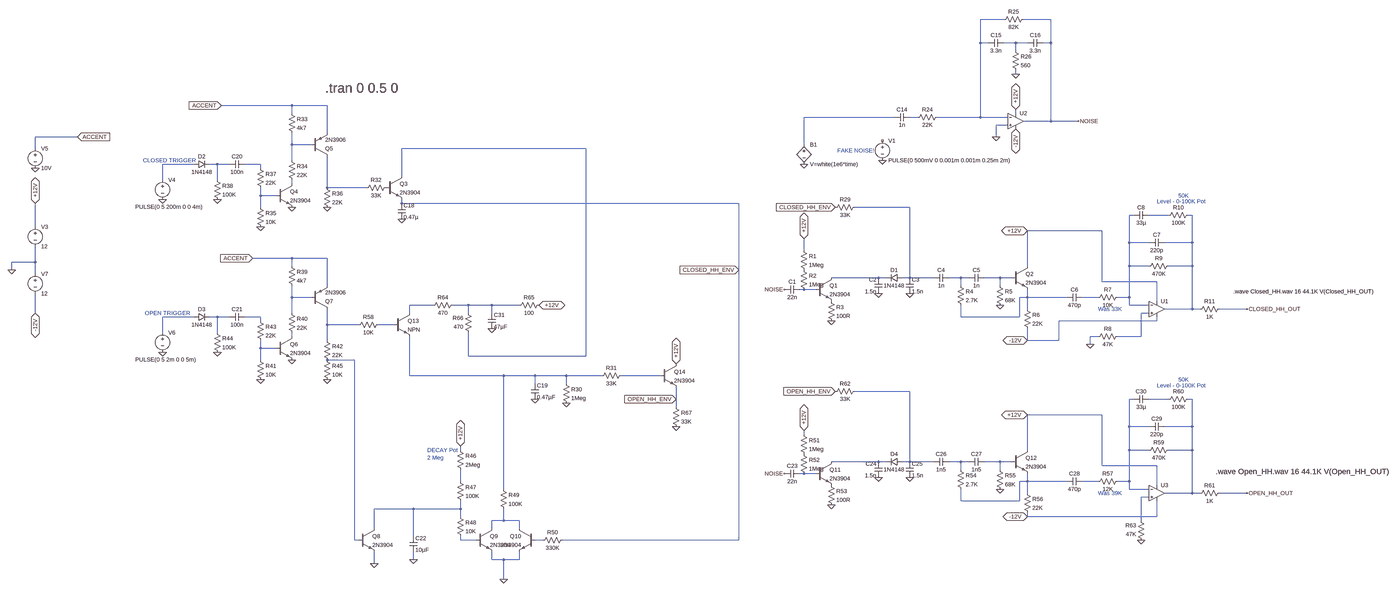
[diagram p0: schematic HH,asc.asc, whole sheet]
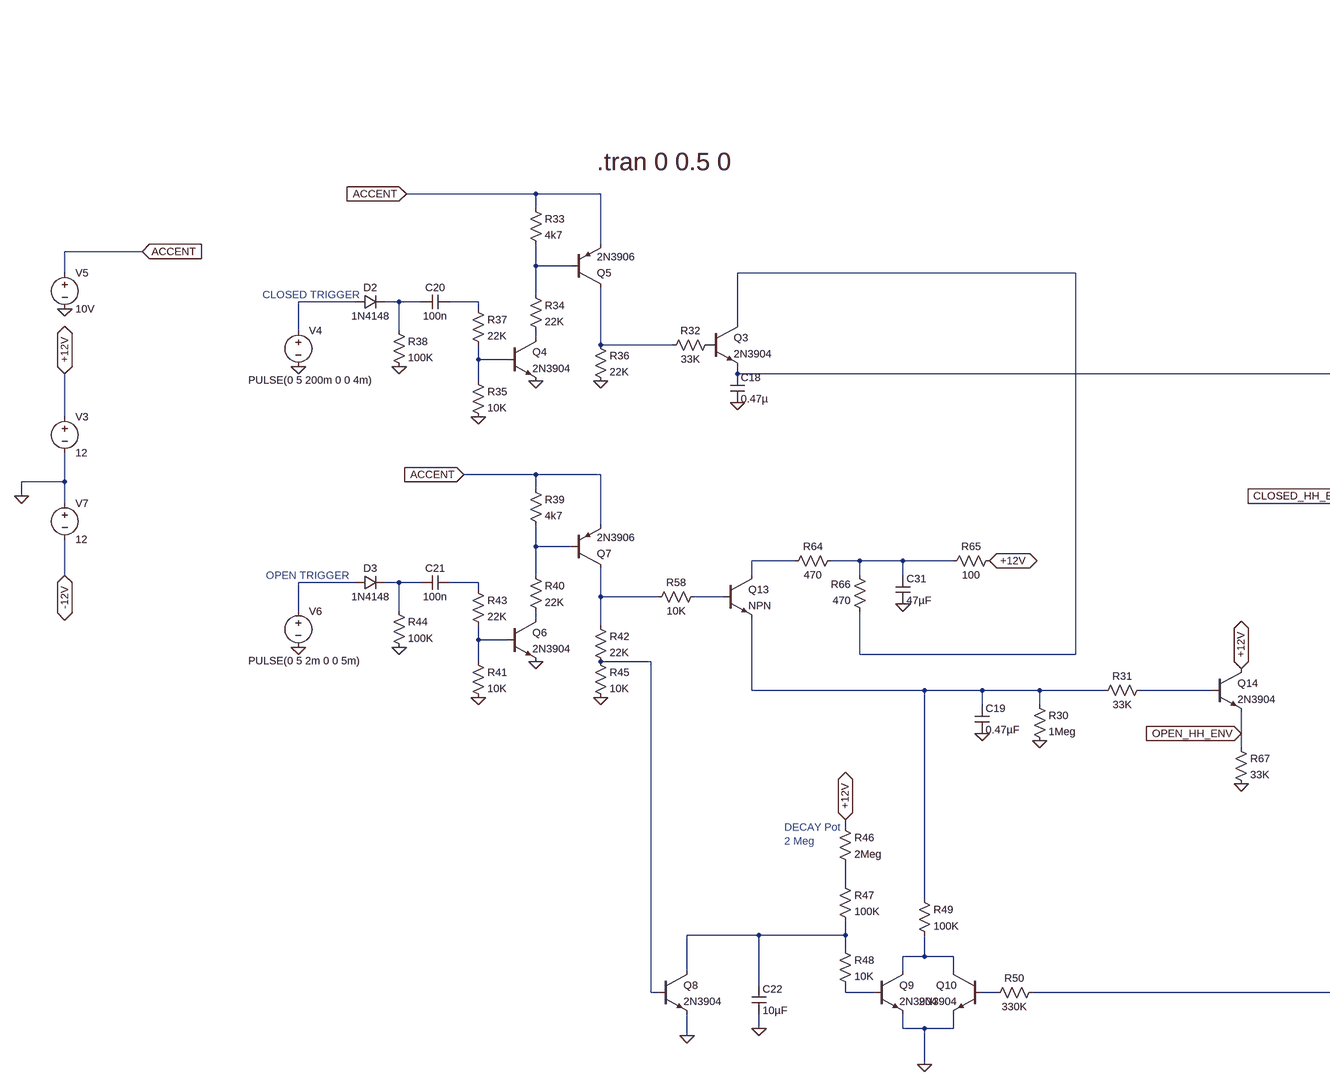
[diagram p1: schematic HH,asc.asc, part, row 1 of 1, column 1 of 2]
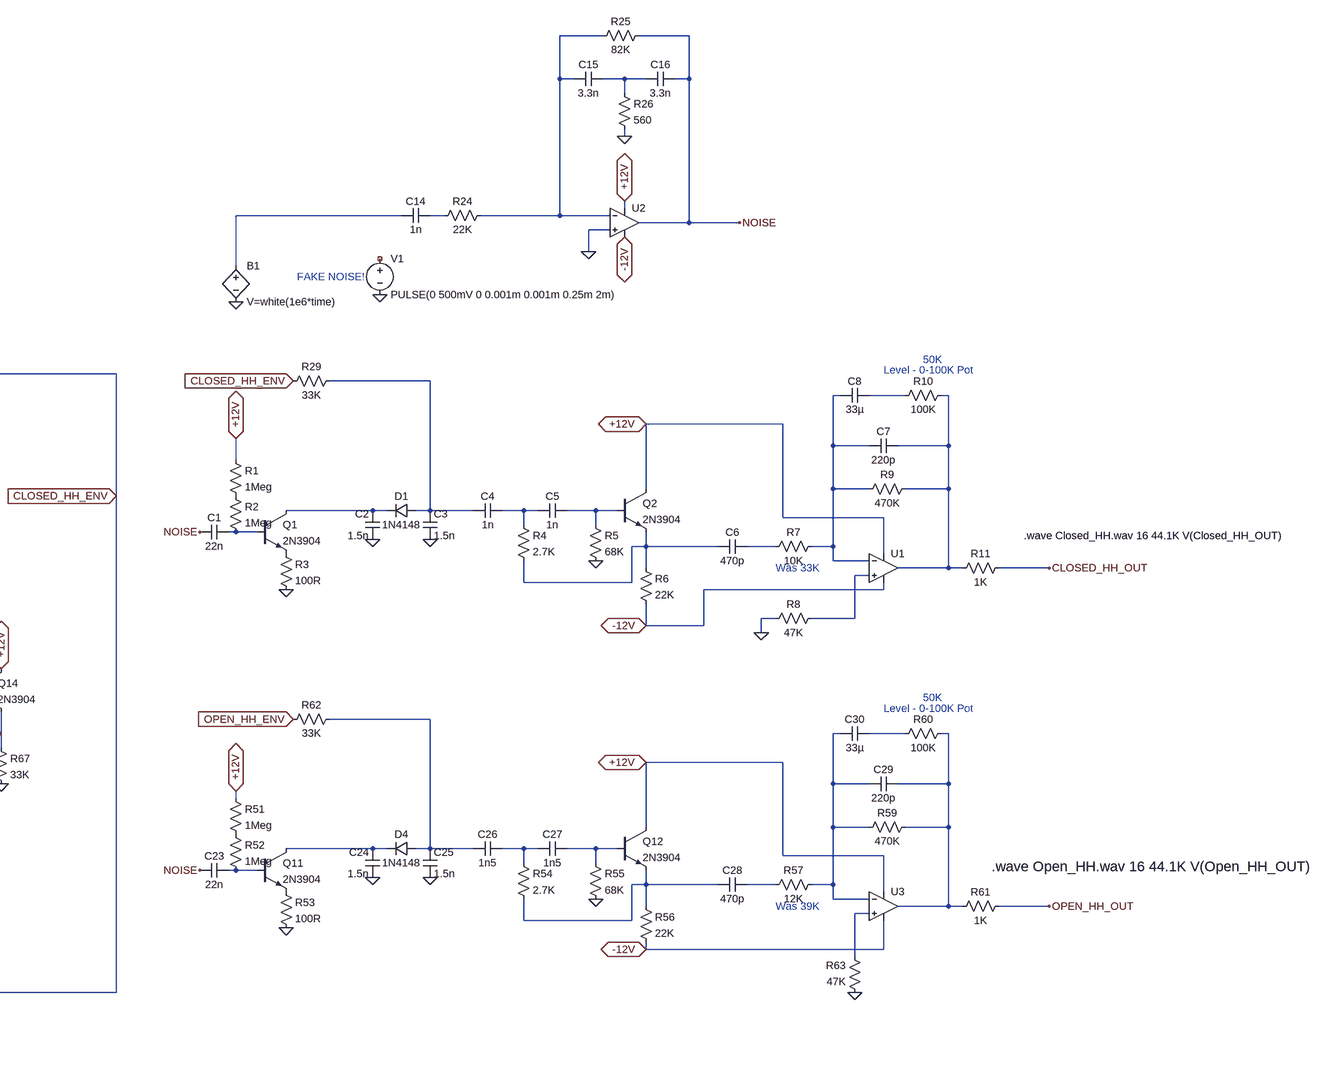
[diagram p2: schematic HH,asc.asc, part, row 1 of 1, column 2 of 2]
HH,asc.asc, the LTspice schematic file:
Version 4
SHEET 1 3256 2740
WIRE 1632 208 1536 208
WIRE 1824 208 1712 208
WIRE 1536 304 1536 208
WIRE 1568 304 1536 304
WIRE 1680 304 1632 304
WIRE 1728 304 1680 304
WIRE 1824 304 1824 208
WIRE 1824 304 1792 304
WIRE 1680 336 1680 304
WIRE 1680 432 1680 416
WIRE -1472 560 -1760 560
WIRE -1328 560 -1472 560
WIRE -1472 592 -1472 560
WIRE 1680 592 1680 576
WIRE 1184 608 816 608
WIRE 1280 608 1248 608
WIRE 1536 608 1536 304
WIRE 1536 608 1360 608
WIRE 1648 608 1536 608
WIRE 1824 624 1824 304
WIRE 1824 624 1712 624
WIRE 1936 624 1824 624
WIRE 1648 640 1600 640
WIRE -1328 672 -1328 560
WIRE -2544 688 -2736 688
WIRE 1600 688 1600 640
WIRE -1472 720 -1472 672
WIRE -1392 720 -1472 720
WIRE 816 720 816 608
WIRE -2736 736 -2736 688
WIRE -272 736 -1024 736
WIRE -1472 784 -1472 720
WIRE -1872 800 -2000 800
WIRE -1776 800 -1808 800
WIRE -1728 800 -1776 800
WIRE -1600 800 -1664 800
WIRE -1600 816 -1600 800
WIRE -1024 848 -1024 736
WIRE -2000 864 -2000 800
WIRE -1776 864 -1776 800
WIRE -1472 880 -1472 864
WIRE -1328 896 -1328 768
WIRE -1168 896 -1328 896
WIRE -1600 928 -1600 896
WIRE -1536 928 -1600 928
WIRE -1024 960 -1024 944
WIRE 352 960 -1024 960
WIRE -1600 976 -1600 928
WIRE 1248 976 1024 976
WIRE 2160 1008 2144 1008
WIRE 2304 1008 2224 1008
WIRE 2400 1008 2384 1008
WIRE -2736 1056 -2736 960
WIRE 2032 1072 1728 1072
WIRE 2144 1120 2144 1008
WIRE 2224 1120 2144 1120
WIRE 2400 1120 2400 1008
WIRE 2400 1120 2288 1120
WIRE 816 1152 816 1104
WIRE -1472 1184 -1632 1184
WIRE -1328 1184 -1472 1184
WIRE -2736 1200 -2736 1136
WIRE -2736 1200 -2832 1200
WIRE -1472 1216 -1472 1184
WIRE 1728 1216 1728 1072
WIRE 2144 1216 2144 1120
WIRE 2224 1216 2144 1216
WIRE 2400 1216 2400 1120
WIRE 2400 1216 2304 1216
WIRE -2832 1232 -2832 1200
WIRE 352 1232 352 960
WIRE -2736 1248 -2736 1200
WIRE 1120 1264 928 1264
WIRE 1152 1264 1120 1264
WIRE 1248 1264 1248 976
WIRE 1248 1264 1216 1264
WIRE 1344 1264 1248 1264
WIRE 1456 1264 1408 1264
WIRE 1488 1264 1456 1264
WIRE 1616 1264 1552 1264
WIRE 1664 1264 1616 1264
WIRE 2032 1280 2032 1072
WIRE 2256 1280 2032 1280
WIRE -1328 1296 -1328 1184
WIRE 1456 1296 1456 1264
WIRE 1616 1296 1616 1264
WIRE 816 1312 800 1312
WIRE 864 1312 816 1312
WIRE -1472 1344 -1472 1296
WIRE -1392 1344 -1472 1344
WIRE 1728 1344 1728 1312
WIRE 1728 1344 1696 1344
WIRE 1888 1344 1728 1344
WIRE 2016 1344 1952 1344
WIRE 2144 1344 2144 1216
WIRE 2144 1344 2096 1344
WIRE 2256 1360 2256 1280
WIRE -896 1376 -992 1376
WIRE -752 1376 -816 1376
WIRE -656 1376 -752 1376
WIRE -544 1376 -656 1376
WIRE 2144 1376 2144 1344
WIRE 2224 1376 2144 1376
WIRE 1728 1392 1728 1344
WIRE 2400 1392 2400 1216
WIRE 2400 1392 2288 1392
WIRE 2432 1392 2400 1392
WIRE 2624 1392 2512 1392
WIRE -2736 1408 -2736 1328
WIRE -1472 1408 -1472 1344
WIRE -992 1408 -992 1376
WIRE -752 1408 -752 1376
WIRE -656 1408 -656 1376
WIRE 2224 1408 2192 1408
WIRE -1872 1424 -2000 1424
WIRE -1776 1424 -1808 1424
WIRE -1728 1424 -1776 1424
WIRE -1600 1424 -1664 1424
WIRE 1456 1424 1456 1376
WIRE 1696 1424 1696 1344
WIRE 1696 1424 1456 1424
WIRE -1600 1440 -1600 1424
WIRE 2256 1440 2256 1424
WIRE 2256 1440 1856 1440
WIRE -1328 1456 -1328 1392
WIRE -1200 1456 -1328 1456
WIRE -1056 1456 -1120 1456
WIRE -2000 1488 -2000 1424
WIRE -1776 1488 -1776 1424
WIRE -1472 1504 -1472 1488
WIRE 2016 1504 1984 1504
WIRE 2192 1504 2192 1408
WIRE 2192 1504 2096 1504
WIRE -1328 1520 -1328 1456
WIRE 1728 1520 1728 1472
WIRE 1856 1520 1856 1440
WIRE 1856 1520 1728 1520
WIRE 1984 1536 1984 1504
WIRE -1600 1552 -1600 1520
WIRE -1536 1552 -1600 1552
WIRE -752 1584 -752 1488
WIRE -272 1584 -272 736
WIRE -272 1584 -752 1584
WIRE -1600 1600 -1600 1552
WIRE -1216 1600 -1328 1600
WIRE -992 1664 -992 1504
WIRE -608 1664 -992 1664
WIRE -480 1664 -608 1664
WIRE -352 1664 -480 1664
WIRE -208 1664 -352 1664
WIRE 32 1664 -128 1664
WIRE -480 1696 -480 1664
WIRE -352 1696 -352 1664
WIRE 1248 1728 1024 1728
WIRE 96 1760 96 1712
WIRE 2160 1760 2144 1760
WIRE 2304 1760 2224 1760
WIRE 2400 1760 2384 1760
WIRE 96 1792 96 1760
WIRE 2032 1824 1728 1824
WIRE 2144 1872 2144 1760
WIRE 2224 1872 2144 1872
WIRE 2400 1872 2400 1760
WIRE 2400 1872 2288 1872
WIRE 816 1904 816 1888
WIRE -784 1968 -784 1952
WIRE 1728 1968 1728 1824
WIRE 2144 1968 2144 1872
WIRE 2224 1968 2144 1968
WIRE 2400 1968 2400 1872
WIRE 2400 1968 2304 1968
WIRE 1120 2016 928 2016
WIRE 1152 2016 1120 2016
WIRE 1248 2016 1248 1728
WIRE 1248 2016 1216 2016
WIRE 1344 2016 1248 2016
WIRE 1456 2016 1408 2016
WIRE 1488 2016 1456 2016
WIRE 1616 2016 1552 2016
WIRE 1664 2016 1616 2016
WIRE 2032 2032 2032 1824
WIRE 2256 2032 2032 2032
WIRE 1456 2048 1456 2016
WIRE 1616 2048 1616 2016
WIRE 816 2064 800 2064
WIRE 864 2064 816 2064
WIRE -784 2096 -784 2048
WIRE 1728 2096 1728 2064
WIRE 1728 2096 1696 2096
WIRE 1888 2096 1728 2096
WIRE 2016 2096 1952 2096
WIRE 2144 2096 2144 1968
WIRE 2144 2096 2096 2096
WIRE 2256 2112 2256 2032
WIRE -608 2128 -608 1664
WIRE 2144 2128 2144 2096
WIRE 2224 2128 2144 2128
WIRE 1728 2144 1728 2096
WIRE 2400 2144 2400 1968
WIRE 2400 2144 2288 2144
WIRE 2432 2144 2400 2144
WIRE 2624 2144 2512 2144
WIRE 2224 2160 2192 2160
WIRE 1456 2176 1456 2128
WIRE 1696 2176 1696 2096
WIRE 1696 2176 1456 2176
WIRE -976 2208 -1136 2208
WIRE -784 2208 -784 2176
WIRE -784 2208 -976 2208
WIRE -784 2240 -784 2208
WIRE 1728 2240 1728 2224
WIRE 2256 2240 2256 2176
WIRE 2256 2240 1728 2240
WIRE -608 2256 -608 2208
WIRE -608 2256 -656 2256
WIRE -544 2256 -608 2256
WIRE 2192 2256 2192 2160
WIRE -1136 2288 -1136 2208
WIRE -656 2288 -656 2256
WIRE -544 2288 -544 2256
WIRE -976 2320 -976 2208
WIRE -1216 2336 -1216 1600
WIRE -1200 2336 -1216 2336
WIRE -784 2336 -784 2320
WIRE -720 2336 -784 2336
WIRE -448 2336 -480 2336
WIRE 352 2336 352 1232
WIRE 352 2336 -368 2336
WIRE -976 2416 -976 2384
WIRE -656 2416 -656 2384
WIRE -608 2416 -656 2416
WIRE -544 2416 -544 2384
WIRE -544 2416 -608 2416
WIRE -1136 2432 -1136 2384
WIRE -608 2496 -608 2416
FLAG 1120 1328 0
FLAG 1248 1328 0
FLAG 1616 1376 0
FLAG 928 1440 0
FLAG 1984 1536 0
FLAG 2624 1392 CLOSED_HH_OUT
FLAG 1680 432 0
FLAG 1600 688 0
FLAG 1936 624 NOISE
FLAG 736 1312 NOISE
FLAG 944 976 CLOSED_HH_ENV
IOPIN 944 976 In
FLAG -1024 1024 0
FLAG 352 1232 CLOSED_HH_ENV
IOPIN 352 1232 In
FLAG -1328 976 0
FLAG -1472 976 0
FLAG -1600 1056 0
FLAG -2000 944 0
FLAG -1760 560 ACCENT
IOPIN -1760 560 In
FLAG -1776 944 0
FLAG -1472 1600 0
FLAG -1600 1680 0
FLAG -2000 1568 0
FLAG -1632 1184 ACCENT
IOPIN -1632 1184 In
FLAG -1776 1568 0
FLAG -1328 1680 0
FLAG -1136 2432 0
FLAG -976 2416 0
FLAG -608 2496 0
FLAG 1120 2080 0
FLAG 1248 2080 0
FLAG 1616 2128 0
FLAG 928 2192 0
FLAG 2192 2336 0
FLAG 2624 2144 OPEN_HH_OUT
FLAG 736 2064 NOISE
FLAG 944 1728 OPEN_HH_ENV
IOPIN 944 1728 In
FLAG -2736 816 0
FLAG -2544 688 ACCENT
IOPIN -2544 688 In
FLAG -2832 1232 0
FLAG -2736 960 +12V
IOPIN -2736 960 BiDir
FLAG -2736 1408 -12V
IOPIN -2736 1408 BiDir
FLAG 1680 576 +12V
IOPIN 1680 576 BiDir
FLAG 1680 656 -12V
IOPIN 1680 656 BiDir
FLAG -784 1952 +12V
IOPIN -784 1952 BiDir
FLAG 1728 1072 +12V
IOPIN 1728 1072 BiDir
FLAG 1728 1520 -12V
IOPIN 1728 1520 BiDir
FLAG 816 1104 +12V
IOPIN 816 1104 BiDir
FLAG 816 1888 +12V
IOPIN 816 1888 BiDir
FLAG 1728 1824 +12V
IOPIN 1728 1824 BiDir
FLAG 1728 2240 -12V
IOPIN 1728 2240 BiDir
FLAG -464 1376 +12V
IOPIN -464 1376 BiDir
FLAG -656 1472 0
FLAG 96 1872 0
FLAG -480 1760 0
FLAG -352 1776 0
FLAG 96 1616 +12V
IOPIN 96 1616 BiDir
FLAG 96 1760 OPEN_HH_ENV
IOPIN 96 1760 In
FLAG 1136 784 0
FLAG 816 800 0
SYMBOL res 800 1136 R0
SYMATTR InstName R1
SYMATTR Value 1Meg
SYMBOL res 800 1216 R0
SYMATTR InstName R2
SYMATTR Value 1Meg
SYMBOL npn 864 1264 R0
SYMATTR InstName Q1
SYMATTR Value 2N3904
SYMBOL res 912 1344 R0
SYMATTR InstName R3
SYMATTR Value 100R
SYMBOL cap 800 1296 R90
WINDOW 0 0 32 VBottom 2
WINDOW 3 32 32 VTop 2
SYMATTR InstName C1
SYMATTR Value 22n
SYMBOL cap 1136 1328 R180
WINDOW 0 24 56 Left 2
WINDOW 3 24 8 Left 2
SYMATTR InstName C2
SYMATTR Value 1.5n
SYMBOL diode 1216 1248 R90
WINDOW 0 0 32 VBottom 2
WINDOW 3 32 32 VTop 2
SYMATTR InstName D1
SYMATTR Value 1N4148
SYMBOL cap 1232 1264 R0
SYMATTR InstName C3
SYMATTR Value 1.5n
SYMBOL cap 1408 1248 R90
WINDOW 0 0 32 VBottom 2
WINDOW 3 32 32 VTop 2
SYMATTR InstName C4
SYMATTR Value 1n
SYMBOL cap 1552 1248 R90
WINDOW 0 0 32 VBottom 2
WINDOW 3 32 32 VTop 2
SYMATTR InstName C5
SYMATTR Value 1n
SYMBOL res 1440 1280 R0
SYMATTR InstName R4
SYMATTR Value 2.7K
SYMBOL res 1600 1280 R0
SYMATTR InstName R5
SYMATTR Value 68K
SYMBOL npn 1664 1216 R0
SYMATTR InstName Q2
SYMATTR Value 2N3904
SYMBOL res 1712 1376 R0
SYMATTR InstName R6
SYMATTR Value 22K
SYMBOL cap 1888 1328 M90
WINDOW 0 0 32 VBottom 2
WINDOW 3 32 32 VTop 2
SYMATTR InstName C6
SYMATTR Value 470p
SYMBOL res 2112 1328 R90
WINDOW 0 0 56 VBottom 2
WINDOW 3 32 56 VTop 2
SYMATTR InstName R7
SYMATTR Value 10K
SYMBOL res 2112 1488 R90
WINDOW 0 0 56 VBottom 2
WINDOW 3 32 56 VTop 2
SYMATTR InstName R8
SYMATTR Value 47K
SYMBOL res 2320 1200 R90
WINDOW 0 0 56 VBottom 2
WINDOW 3 32 56 VTop 2
SYMATTR InstName R9
SYMATTR Value 470K
SYMBOL cap 2288 1104 R90
WINDOW 0 0 32 VBottom 2
WINDOW 3 32 32 VTop 2
SYMATTR InstName C7
SYMATTR Value 220p
SYMBOL cap 2224 992 R90
WINDOW 0 0 32 VBottom 2
WINDOW 3 32 32 VTop 2
SYMATTR InstName C8
SYMATTR Value 33µ
SYMBOL res 2400 992 R90
WINDOW 0 0 56 VBottom 2
WINDOW 3 32 56 VTop 2
SYMATTR InstName R10
SYMATTR Value 100K
SYMBOL OpAmps\\UniversalOpamp 2256 1392 R0
SYMATTR InstName U1
SYMBOL res 2528 1376 R90
WINDOW 0 0 56 VBottom 2
WINDOW 3 32 56 VTop 2
SYMATTR InstName R11
SYMATTR Value 1K
SYMBOL cap 1248 592 R90
WINDOW 0 0 32 VBottom 2
WINDOW 3 32 32 VTop 2
SYMATTR InstName C14
SYMATTR Value 1n
SYMBOL res 1376 592 R90
WINDOW 0 0 56 VBottom 2
WINDOW 3 32 56 VTop 2
SYMATTR InstName R24
SYMATTR Value 22K
SYMBOL res 1728 192 R90
WINDOW 0 0 56 VBottom 2
WINDOW 3 32 56 VTop 2
SYMATTR InstName R25
SYMATTR Value 82K
SYMBOL OpAmps\\UniversalOpamp 1680 624 R0
SYMATTR InstName U2
SYMBOL cap 1632 288 R90
WINDOW 0 0 32 VBottom 2
WINDOW 3 32 32 VTop 2
SYMATTR InstName C15
SYMATTR Value 3.3n
SYMBOL cap 1792 288 R90
WINDOW 0 0 32 VBottom 2
WINDOW 3 32 32 VTop 2
SYMATTR InstName C16
SYMATTR Value 3.3n
SYMBOL res 1664 320 R0
SYMATTR InstName R26
SYMATTR Value 560
SYMBOL res 1040 960 R90
WINDOW 0 0 56 VBottom 2
WINDOW 3 32 56 VTop 2
SYMATTR InstName R29
SYMATTR Value 33K
SYMBOL npn -1088 848 R0
SYMATTR InstName Q3
SYMATTR Value 2N3904
SYMBOL cap -1040 960 R0
SYMATTR InstName C18
SYMATTR Value 0.47µ
SYMBOL npn -1536 880 R0
SYMATTR InstName Q4
SYMATTR Value 2N3904
SYMBOL res -1072 880 R90
WINDOW 0 0 56 VBottom 2
WINDOW 3 32 56 VTop 2
SYMATTR InstName R32
SYMATTR Value 33K
SYMBOL res -1488 576 R0
SYMATTR InstName R33
SYMATTR Value 4k7
SYMBOL res -1488 768 R0
SYMATTR InstName R34
SYMATTR Value 22K
SYMBOL res -1616 960 R0
SYMATTR InstName R35
SYMATTR Value 10K
SYMBOL res -1344 880 R0
SYMATTR InstName R36
SYMATTR Value 22K
SYMBOL pnp -1392 768 M180
SYMATTR InstName Q5
SYMATTR Value 2N3906
SYMBOL voltage -2000 848 R0
WINDOW 3 -111 126 Left 2
WINDOW 123 0 0 Left 0
WINDOW 39 0 0 Left 0
SYMATTR Value PULSE(0 5 200m 0 0 4m)
SYMATTR InstName V4
SYMBOL diode -1872 816 R270
WINDOW 0 32 32 VTop 2
WINDOW 3 0 32 VBottom 2
SYMATTR InstName D2
SYMATTR Value 1N4148
SYMBOL res -1616 800 R0
SYMATTR InstName R37
SYMATTR Value 22K
SYMBOL res -1792 848 R0
SYMATTR InstName R38
SYMATTR Value 100K
SYMBOL cap -1664 784 R90
WINDOW 0 0 32 VBottom 2
WINDOW 3 32 32 VTop 2
SYMATTR InstName C20
SYMATTR Value 100n
SYMBOL npn -1536 1504 R0
SYMATTR InstName Q6
SYMATTR Value 2N3904
SYMBOL res -1488 1200 R0
SYMATTR InstName R39
SYMATTR Value 4k7
SYMBOL res -1488 1392 R0
SYMATTR InstName R40
SYMATTR Value 22K
SYMBOL res -1616 1584 R0
SYMATTR InstName R41
SYMATTR Value 10K
SYMBOL res -1344 1504 R0
SYMATTR InstName R42
SYMATTR Value 22K
SYMBOL pnp -1392 1392 M180
SYMATTR InstName Q7
SYMATTR Value 2N3906
SYMBOL voltage -2000 1472 R0
WINDOW 3 -111 126 Left 2
WINDOW 123 0 0 Left 0
WINDOW 39 0 0 Left 0
SYMATTR Value PULSE(0 5 2m 0 0 5m)
SYMATTR InstName V6
SYMBOL diode -1872 1440 R270
WINDOW 0 32 32 VTop 2
WINDOW 3 0 32 VBottom 2
SYMATTR InstName D3
SYMATTR Value 1N4148
SYMBOL res -1616 1424 R0
SYMATTR InstName R43
SYMATTR Value 22K
SYMBOL res -1792 1472 R0
SYMATTR InstName R44
SYMATTR Value 100K
SYMBOL cap -1664 1408 R90
WINDOW 0 0 32 VBottom 2
WINDOW 3 32 32 VTop 2
SYMATTR InstName C21
SYMATTR Value 100n
SYMBOL res -1344 1584 R0
SYMATTR InstName R45
SYMATTR Value 10K
SYMBOL npn -1200 2288 R0
SYMATTR InstName Q8
SYMATTR Value 2N3904
SYMBOL res -800 1952 R0
SYMATTR InstName R46
SYMATTR Value 2Meg
SYMBOL res -800 2080 R0
SYMATTR InstName R47
SYMATTR Value 100K
SYMBOL res -800 2224 R0
SYMATTR InstName R48
SYMATTR Value 10K
SYMBOL npn -720 2288 R0
SYMATTR InstName Q9
SYMATTR Value 2N3904
SYMBOL npn -480 2288 M0
SYMATTR InstName Q10
SYMATTR Value 2N3904
SYMBOL cap -992 2320 R0
SYMATTR InstName C22
SYMATTR Value 10µF
SYMATTR SpiceLine V=16V
SYMBOL res -624 2112 R0
SYMATTR InstName R49
SYMATTR Value 100K
SYMBOL res -352 2320 R90
WINDOW 0 0 56 VBottom 2
WINDOW 3 32 56 VTop 2
SYMATTR InstName R50
SYMATTR Value 330K
SYMBOL res 800 1888 R0
SYMATTR InstName R51
SYMATTR Value 1Meg
SYMBOL res 800 1968 R0
SYMATTR InstName R52
SYMATTR Value 1Meg
SYMBOL npn 864 2016 R0
SYMATTR InstName Q11
SYMATTR Value 2N3904
SYMBOL res 912 2096 R0
SYMATTR InstName R53
SYMATTR Value 100R
SYMBOL cap 800 2048 R90
WINDOW 0 0 32 VBottom 2
WINDOW 3 32 32 VTop 2
SYMATTR InstName C23
SYMATTR Value 22n
SYMBOL cap 1136 2080 R180
WINDOW 0 24 56 Left 2
WINDOW 3 24 8 Left 2
SYMATTR InstName C24
SYMATTR Value 1.5n
SYMBOL diode 1216 2000 R90
WINDOW 0 0 32 VBottom 2
WINDOW 3 32 32 VTop 2
SYMATTR InstName D4
SYMATTR Value 1N4148
SYMBOL cap 1232 2016 R0
SYMATTR InstName C25
SYMATTR Value 1.5n
SYMBOL cap 1408 2000 R90
WINDOW 0 0 32 VBottom 2
WINDOW 3 32 32 VTop 2
SYMATTR InstName C26
SYMATTR Value 1n5
SYMBOL cap 1552 2000 R90
WINDOW 0 0 32 VBottom 2
WINDOW 3 32 32 VTop 2
SYMATTR InstName C27
SYMATTR Value 1n5
SYMBOL res 1440 2032 R0
SYMATTR InstName R54
SYMATTR Value 2.7K
SYMBOL res 1600 2032 R0
SYMATTR InstName R55
SYMATTR Value 68K
SYMBOL npn 1664 1968 R0
SYMATTR InstName Q12
SYMATTR Value 2N3904
SYMBOL res 1712 2128 R0
SYMATTR InstName R56
SYMATTR Value 22K
SYMBOL cap 1888 2080 M90
WINDOW 0 0 32 VBottom 2
WINDOW 3 32 32 VTop 2
SYMATTR InstName C28
SYMATTR Value 470p
SYMBOL res 2112 2080 R90
WINDOW 0 0 56 VBottom 2
WINDOW 3 32 56 VTop 2
SYMATTR InstName R57
SYMATTR Value 12K
SYMBOL res 2320 1952 R90
WINDOW 0 0 56 VBottom 2
WINDOW 3 32 56 VTop 2
SYMATTR InstName R59
SYMATTR Value 470K
SYMBOL cap 2288 1856 R90
WINDOW 0 0 32 VBottom 2
WINDOW 3 32 32 VTop 2
SYMATTR InstName C29
SYMATTR Value 220p
SYMBOL cap 2224 1744 R90
WINDOW 0 0 32 VBottom 2
WINDOW 3 32 32 VTop 2
SYMATTR InstName C30
SYMATTR Value 33µ
SYMBOL res 2400 1744 R90
WINDOW 0 0 56 VBottom 2
WINDOW 3 32 56 VTop 2
SYMATTR InstName R60
SYMATTR Value 100K
SYMBOL OpAmps\\UniversalOpamp 2256 2144 R0
SYMATTR InstName U3
SYMBOL res 2528 2128 R90
WINDOW 0 0 56 VBottom 2
WINDOW 3 32 56 VTop 2
SYMATTR InstName R61
SYMATTR Value 1K
SYMBOL res 1040 1712 R90
WINDOW 0 0 56 VBottom 2
WINDOW 3 32 56 VTop 2
SYMATTR InstName R62
SYMATTR Value 33K
SYMBOL voltage -2736 720 R0
WINDOW 123 0 0 Left 0
WINDOW 39 0 0 Left 0
SYMATTR InstName V5
SYMATTR Value 10V
SYMBOL voltage -2736 1040 R0
WINDOW 123 0 0 Left 0
WINDOW 39 0 0 Left 0
SYMATTR InstName V3
SYMATTR Value 12
SYMBOL voltage -2736 1232 R0
WINDOW 123 0 0 Left 0
WINDOW 39 0 0 Left 0
SYMATTR InstName V7
SYMATTR Value 12
SYMBOL res 2208 2352 R180
WINDOW 0 36 76 Left 2
WINDOW 3 36 40 Left 2
SYMATTR InstName R63
SYMATTR Value 47K
SYMBOL npn -1056 1408 R0
SYMATTR InstName Q13
SYMBOL res -1104 1440 R90
WINDOW 0 0 56 VBottom 2
WINDOW 3 32 56 VTop 2
SYMATTR InstName R58
SYMATTR Value 10K
SYMBOL res -800 1360 R90
WINDOW 0 0 56 VBottom 2
WINDOW 3 32 56 VTop 2
SYMATTR InstName R64
SYMATTR Value 470
SYMBOL res -448 1360 R90
WINDOW 0 0 56 VBottom 2
WINDOW 3 32 56 VTop 2
SYMATTR InstName R65
SYMATTR Value 100
SYMBOL res -736 1504 R180
WINDOW 0 36 76 Left 2
WINDOW 3 36 40 Left 2
SYMATTR InstName R66
SYMATTR Value 470
SYMBOL cap -672 1408 R0
SYMATTR InstName C31
SYMATTR Value 47µF
SYMBOL cap -496 1696 R0
SYMATTR InstName C19
SYMATTR Value 0.47µF
SYMBOL res -368 1680 R0
SYMATTR InstName R30
SYMATTR Value 1Meg
SYMBOL res -112 1648 R90
WINDOW 0 0 56 VBottom 2
WINDOW 3 32 56 VTop 2
SYMATTR InstName R31
SYMATTR Value 33K
SYMBOL npn 32 1616 R0
SYMATTR InstName Q14
SYMATTR Value 2N3904
SYMBOL res 80 1776 R0
SYMATTR InstName R67
SYMATTR Value 33K
SYMBOL voltage 1136 688 R0
WINDOW 123 0 0 Left 0
WINDOW 39 0 0 Left 0
SYMATTR InstName V1
SYMATTR Value PULSE(0 500mV 0 0.001m 0.001m 0.25m 2m)
SYMBOL bv 816 704 R0
SYMATTR InstName B1
SYMATTR Value V=white(1e6*time)
TEXT -1336 488 Left 5 !.tran 0 0.5 0
TEXT 2344 928 Left 2 ;50K
TEXT 2256 952 Left 2 ;Level - 0-100K Pot
TEXT -2080 784 Left 2 ;CLOSED TRIGGER
TEXT -2072 1408 Left 2 ;OPEN TRIGGER
TEXT 2016 1392 Left 2 ;Was 33K
TEXT -920 1968 Left 2 ;DECAY Pot\n2 Meg
TEXT 2344 1680 Left 2 ;50K
TEXT 2256 1704 Left 2 ;Level - 0-100K Pot
TEXT 2016 2144 Left 2 ;Was 39K
TEXT 952 744 Left 2 ;FAKE NOISE!
TEXT 2568 1320 Left 2 !.wave Closed_HH.wav 16 44.1K V(Closed_HH_OUT)
TEXT 2496 2056 Left 3 !.wave Open_HH.wav 16 44.1K V(Open_HH_OUT)

The netlist it stands for:
* HH,asc.asc
R1 +12V P001 1Meg
R2 P001 N020 1Meg
Q1 N017 N020 P002 0 2N3904
R3 P002 0 100R
C1 N020 NOISE 22n
C2 0 N017 1.5n
D1 N013 N017 1N4148
C3 N013 0 1.5n
C4 N018 N013 1n
C5 N019 N018 1n
R4 N018 N022 2.7K
R5 N019 0 68K
Q2 +12V N019 N022 0 2N3904
R6 N022 -12V 22K
C6 N022 N023 470p
R7 N014 N023 10K
R8 N026 0 47K
R9 N016 N014 470K
C7 N016 N014 220p
C8 N015 N014 33µ
R10 N016 N015 100K
XU1 N026 N014 +12V -12V N016 level1 Avol=1Meg GBW=10Meg Vos=0 En=0 Enk=0 In=0 Ink=0 Rin=500Meg  ; pins In+ In- V+ V- OUT
R11 CLOSED_HH_OUT N016 1K
C14 N004 N003 1n
R24 N001 N004 22K
R25 NOISE N001 82K
XU2 0 N001 +12V -12V NOISE level1 Avol=1Meg GBW=10Meg Vos=0 En=0 Enk=0 In=0 Ink=0 Rin=500Meg  ; pins In+ In- V+ V- OUT
C15 N002 N001 3.3n
C16 NOISE N002 3.3n
R26 N002 0 560
R29 N013 CLOSED_HH_ENV 33K
Q3 N006 P003 CLOSED_HH_ENV 0 2N3904
C18 CLOSED_HH_ENV 0 0.47µ
Q4 N010 N012 0 0 2N3904
R32 P003 N011 33K
R33 ACCENT N005 4k7
R34 N005 N010 22K
R35 N012 0 10K
R36 N011 0 22K
Q5 N011 N005 ACCENT 0 2N3906
V4 N007 0 PULSE(0 5 200m 0 0 4m)
D2 N007 N008 1N4148
R37 N009 N012 22K
R38 N008 0 100K
C20 N009 N008 100n
Q6 N032 N033 0 0 2N3904
R39 ACCENT N021 4k7
R40 N021 N032 22K
R41 N033 0 10K
R42 N030 N034 22K
Q7 N030 N021 ACCENT 0 2N3906
V6 N027 0 PULSE(0 5 2m 0 0 5m)
D3 N027 N028 1N4148
R43 N029 N033 22K
R44 N028 0 100K
C21 N029 N028 100n
R45 N034 0 10K
Q8 N049 N034 0 0 2N3904
R46 +12V N045 2Meg
R47 N045 N049 100K
R48 N049 N051 10K
Q9 N050 N051 0 0 2N3904
Q10 N050 N052 0 0 2N3904
C22 N049 0 10µF V=16V
R49 N035 N050 100K
R50 CLOSED_HH_ENV N052 330K
R51 +12V P004 1Meg
R52 P004 N044 1Meg
Q11 N041 N044 P005 0 2N3904
R53 P005 0 100R
C23 N044 NOISE 22n
C24 0 N041 1.5n
D4 N037 N041 1N4148
C25 N037 0 1.5n
C26 N042 N037 1n5
C27 N043 N042 1n5
R54 N042 N046 2.7K
R55 N043 0 68K
Q12 +12V N043 N046 0 2N3904
R56 N046 -12V 22K
C28 N046 N047 470p
R57 N038 N047 12K
R59 N040 N038 470K
C29 N040 N038 220p
C30 N039 N038 33µ
R60 N040 N039 100K
XU3 N048 N038 +12V -12V N040 level1 Avol=1Meg GBW=10Meg Vos=0 En=0 Enk=0 In=0 Ink=0 Rin=500Meg  ; pins In+ In- V+ V- OUT
R61 OPEN_HH_OUT N040 1K
R62 N037 OPEN_HH_ENV 33K
V5 ACCENT 0 10V
V3 +12V 0 12
V7 0 -12V 12
R63 0 N048 47K
Q13 N024 N031 N035 0 NPN
R58 N031 N030 10K
R64 N025 N024 470
R65 +12V N025 100
R66 N006 N025 470
C31 N025 0 47µF
C19 N035 0 0.47µF
R30 N035 0 1Meg
R31 N036 N035 33K
Q14 +12V N036 OPEN_HH_ENV 0 2N3904
R67 OPEN_HH_ENV 0 33K
V1 NC_01 0 PULSE(0 500mV 0 0.001m 0.001m 0.25m 2m)
B1 N003 0 V=white(1e6*time)
.model D D
.lib standard.dio
.model NPN NPN
.model PNP PNP
.lib standard.bjt
.tran 0 0.5 0
* 50K
* Level - 0-100K Pot
* CLOSED TRIGGER
* OPEN TRIGGER
* Was 33K
* DECAY Pot
* 2 Meg
* 50K
* Level - 0-100K Pot
* Was 39K
* FAKE NOISE!
.wave Closed_HH.wav 16 44.1K V(Closed_HH_OUT)
.wave Open_HH.wav 16 44.1K V(Open_HH_OUT)
.lib UniversalOpAmp1.lib
.backanno
.end